# Altium project flight_data_rocket_board.PrjPcb
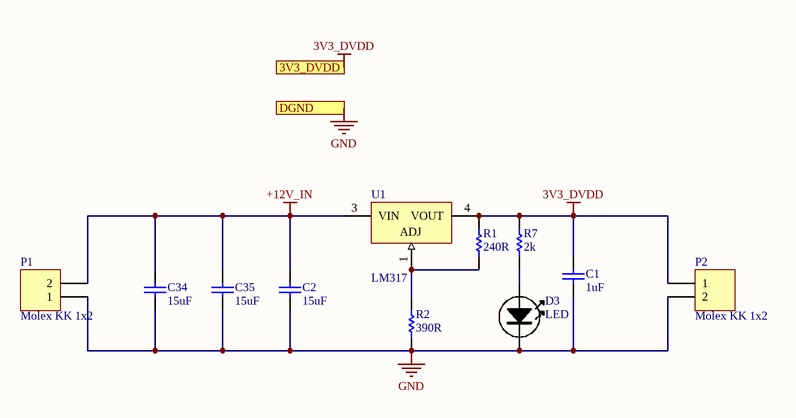
[diagram p0: Power_Schematic.SchDoc]
2 sheets, 16 parts. Net scope: flat (ports and power ports of the same name join across sheets).
Sheets:
  Power_Schematic.SchDoc
  CAN_circuit.SchDoc

## Sheet Power_Schematic.SchDoc
size A

### Parts
C1  1uF  [C0805]
C2  15uF  [C0805]
C34  15uF  [C0805]
C35  15uF  [C0805]
D3  LED  [0805LED]
P1  Molex KK 1x2  [Molex KK 2x1]
P2  Molex KK 1x2  [Molex KK 2x1]
R1  240R  [R0805]
R2  390R  [R0805]
R7  2k  [R0805]
U1  LM317  [D-PAK]

### Ports
3V3_DVDD, DGND

### Nets
3V3_DVDD: C1.1 P2.1 R1.2 R7.2 U1.4(VOUT) ; port 3V3_DVDD
+12V_IN: C2.1 C34.1 C35.1 P1.2 U1.3(VIN)
GND: C1.2 C2.2 C34.2 C35.2 D3.K P1.1 P2.2 R2.1 ; port DGND
NetD3_A: D3.A R7.1
NetR1_1: R1.1 R2.2 U1.1(ADJ)

### Library data of the parts
C1 C2 C34 C35 = C0805: 0805 Capacitor
  C1: Value: 1uF
  C2 C34 C35: Value: 15uF
D3 = LED: Manufacturer: OSRAM Opto Semiconductors Inc; Manufacturer Part Number: LS T676-Q1R2-1-Z; Reel: D13
P1 P2 = Molex KK 1x2: 1x2 Molex KK Connector
R1 R2 R7 = R0805: RESISTOR 0805
  R1: Value: 240R
  R2: Value: 390R
  R7: Value: 2k
U1 = LM317: Linear Voltage Regulator

## Sheet CAN_circuit.SchDoc
size A
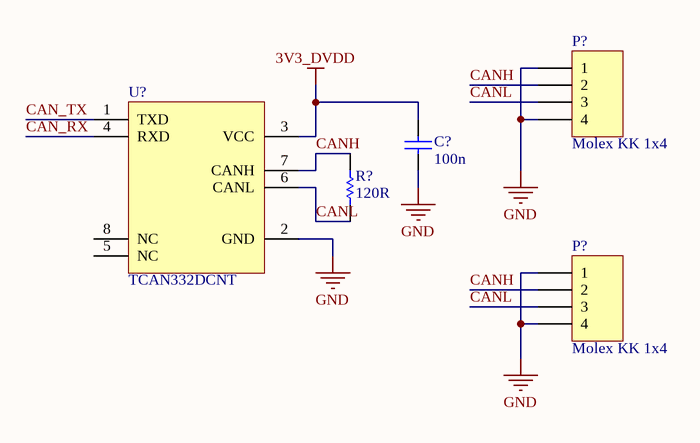
[diagram p1: CAN_circuit.SchDoc]

### Parts
(Parts that share a designator on the sheet are numbered #1, #2 ... from top to bottom, then left to right.)
C?  100n  [C0805]
P?#1  Molex KK 1x4  [Molex KK 4x1]
P?#2  Molex KK 1x4  [Molex KK 4x1]
R?  120R  [R0805]
U?  TCAN332DCNT  [SOT-23-8]

### Nets
3V3_DVDD: C?.1 U?.3(VCC)
GND: C?.2 P?#1.1 P?#1.4 P?#2.1 P?#2.4 U?.2(GND)
CAN_RX: U?.4(RXD)
CAN_TX: U?.1(TXD)
CANH: P?#1.2 P?#2.2 R?.2 U?.7(CANH)
CANL: P?#1.3 P?#2.3 R?.1 U?.6(CANL)

Not connected (* = marked no-connect by the designer): U? 5(NC) 8(NC)

### Library data of the parts
C? = C0805: 0805 Capacitor; Value: 100n
P?#1 P?#2 = Molex KK 1x4: 1x4 Molex KK Connector
R? = R0805: RESISTOR 0805; Value: 120R
U? = TCAN332DCNT: IC TXRX CAN 3.3V SOT23-8

## Nets that join several sheets
3V3_DVDD: Power_Schematic (5 pins), CAN_circuit (C?.1 U?.3)
GND: Power_Schematic (8 pins), CAN_circuit (6 pins)